# EAGLE design New_Multirotor_GPS (EAGLE 6.3)
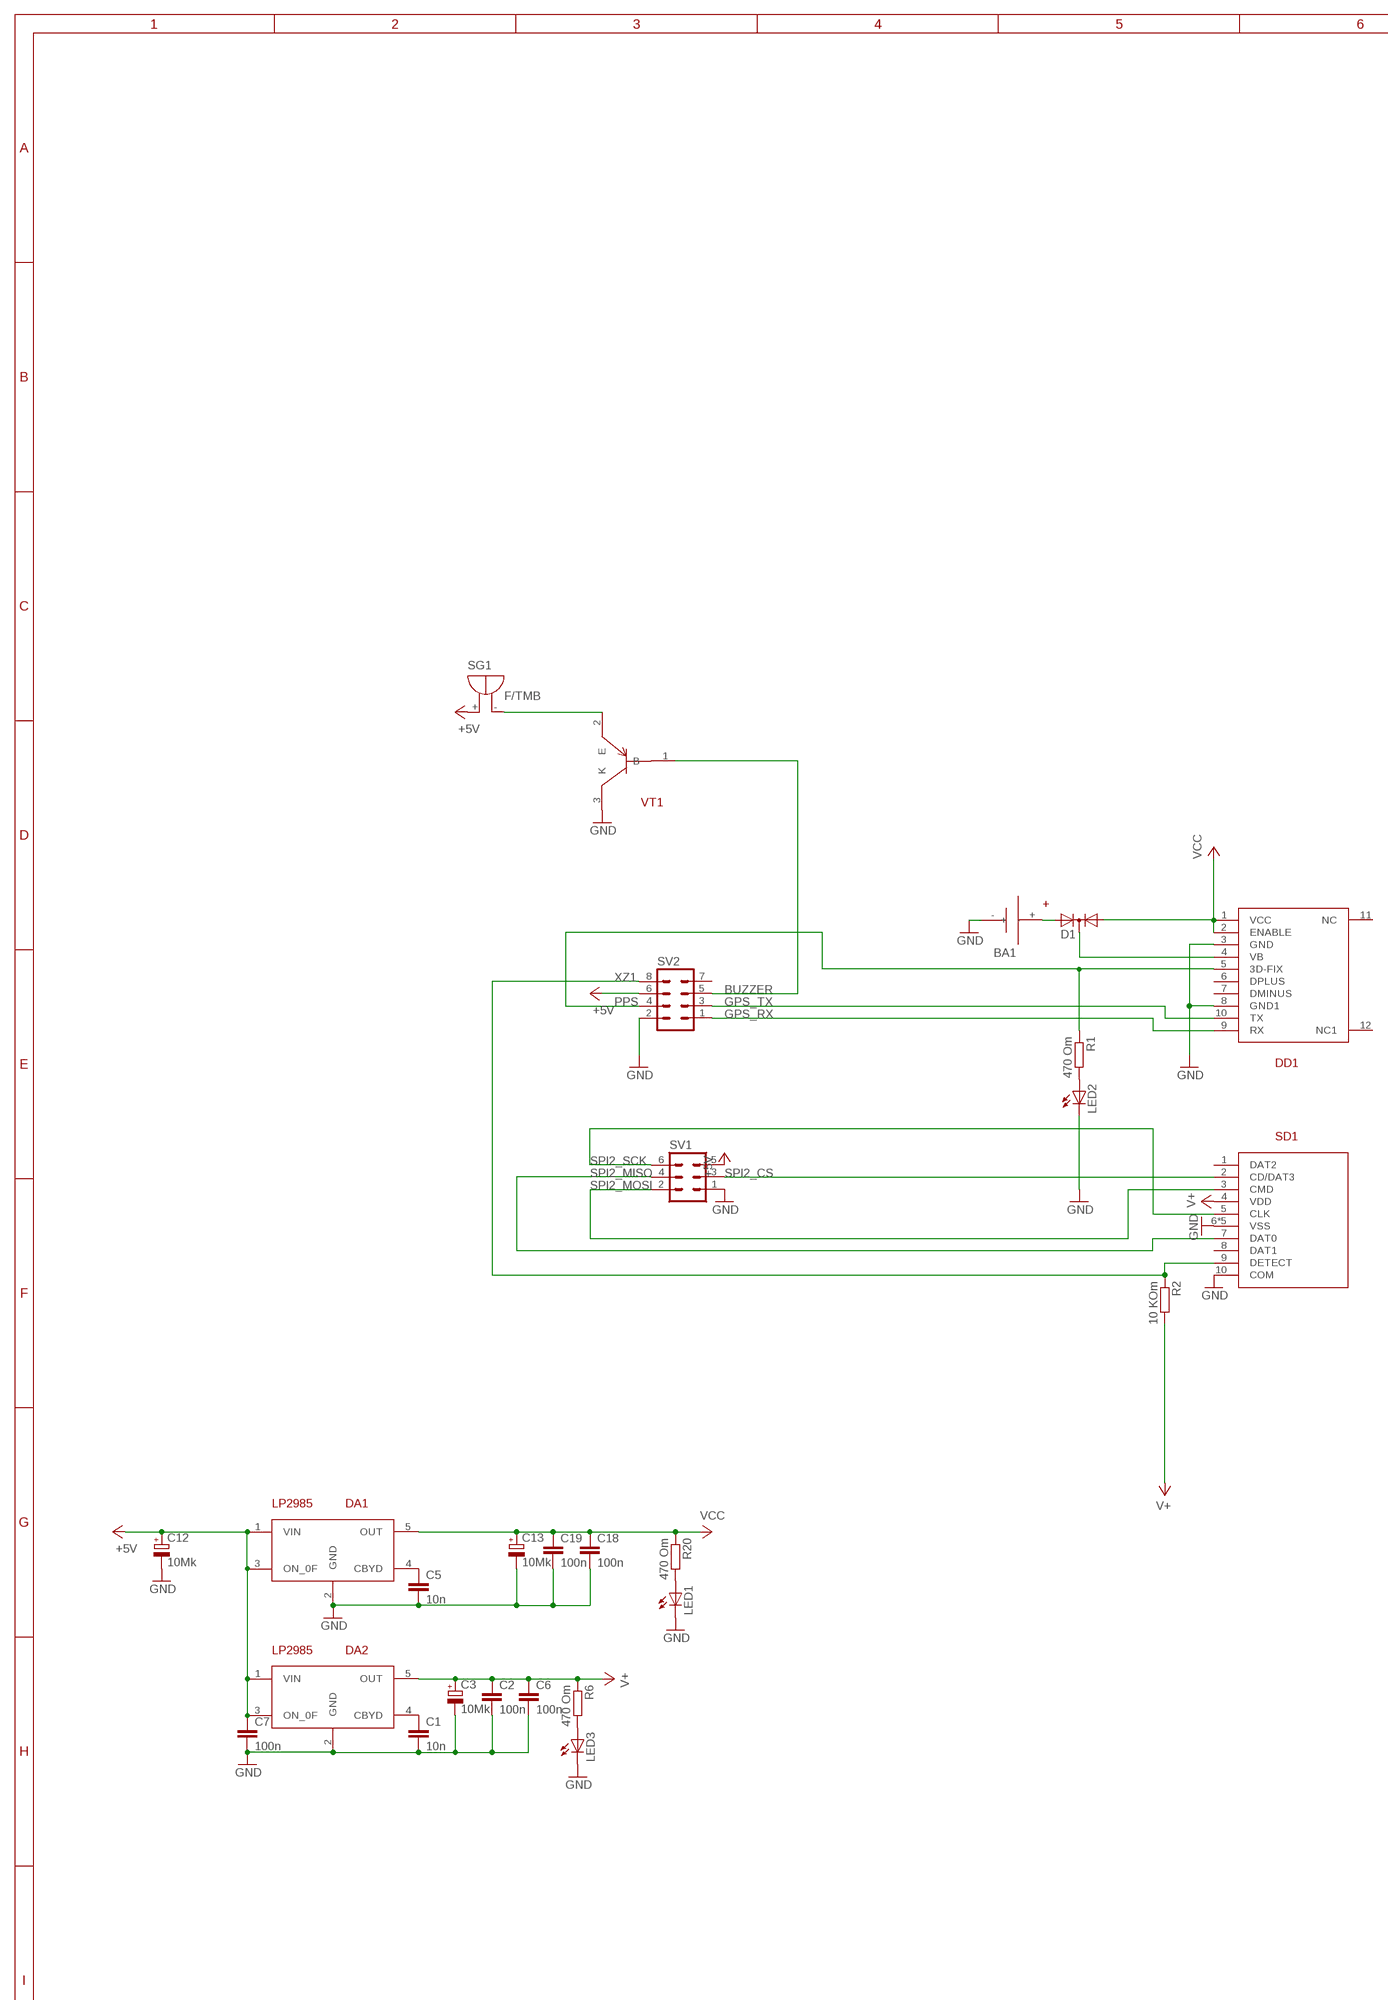
[diagram p0: schematic, sheet 1, part 1 of 2]
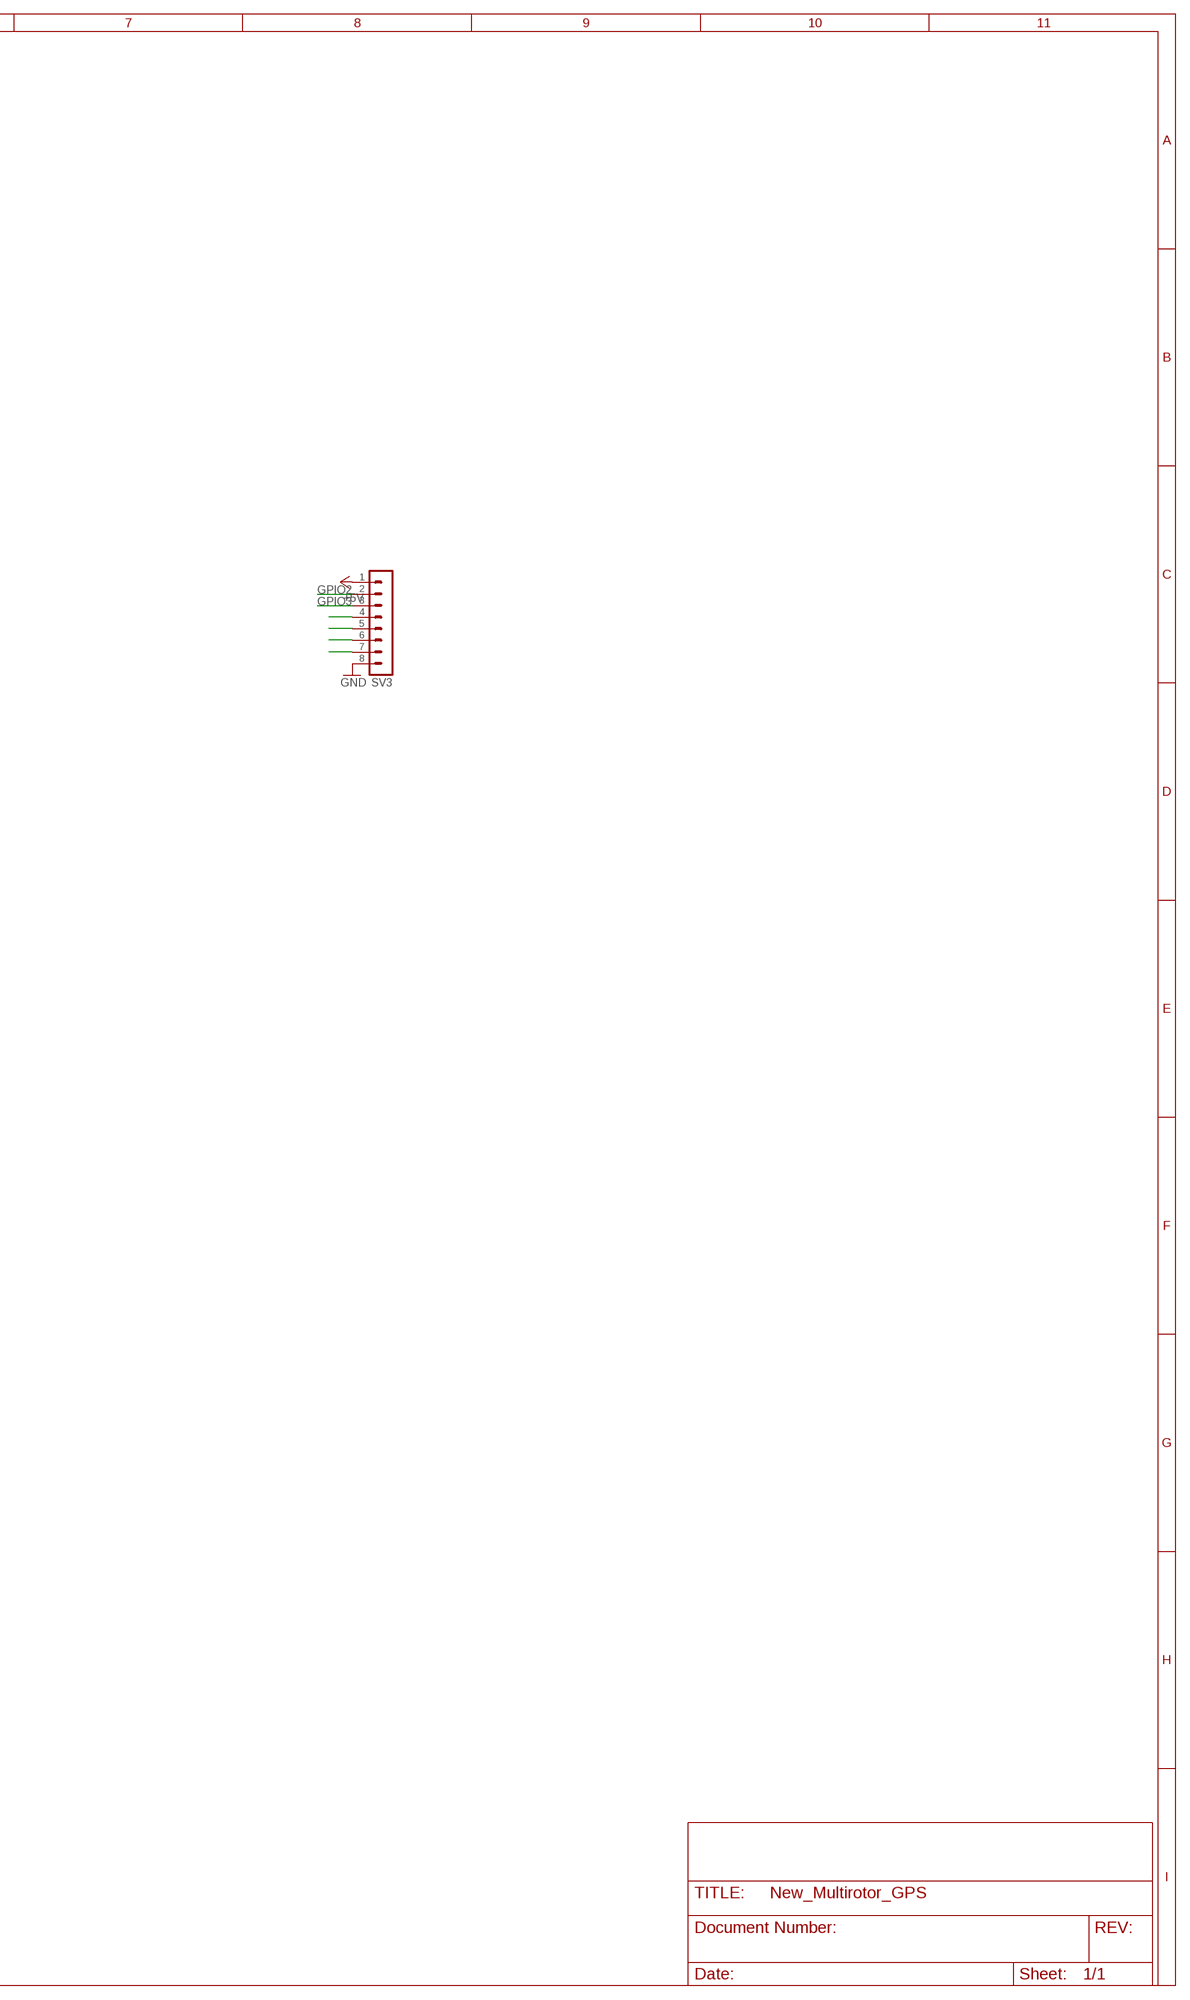
[diagram p1: schematic, sheet 1, part 2 of 2]

## Parts
BA1  BAT  [BAT]
C1  10n  C-EUC0603K  [C0603K]
C2  100n  C-EUC0603K  [C0603K]
C3  10Mk  CPOL-EUA/3216-18W  [A/3216-18W]
C5  10n  C-EUC0603K  [C0603K]
C6  100n  C-EUC0603K  [C0603K]
C7  100n  C-EUC0603K  [C0603K]
C12  10Mk  CPOL-EUA/3216-18W  [A/3216-18W]
C13  10Mk  CPOL-EUA/3216-18W  [A/3216-18W]
C18  100n  C-EUC0603K  [C0603K]
C19  100n  C-EUC0603K  [C0603K]
D1  DIODE-2AC|CASOT23  [SOT23]
DA1  LP2985  3.3  [SOT23-5L]
DA2  LP2985  3.3  [SOT23-5L]
DD1  FGPMMOPA6B  [FGPMMOPA6B]
LED1  LEDCHIPLED_0603  [CHIPLED_0603]
LED2  LEDCHIPLED_0603  [CHIPLED_0603]
LED3  LEDCHIPLED_0603  [CHIPLED_0603]
R1  470 Om  R-EU_R0603  [R0603]
R2  10 KOm  R-EU_R0603  [R0603]
R6  470 Om  R-EU_R0603  [R0603]
R20  470 Om  R-EU_R0603  [R0603]
SD1  MICROCD_MAIN  [MICROSD_MAIN]
SG1  F/TMB  [F/TMB]
SV1  MA03-2  [MA03-2]
SV2  MA04-2  [MA04-2]
SV3  MA08-1  [MA08-1]
VT1  MMBT3906  [SOT23B-3]

## Nets
+5V: C7.1 C12.+ DA1.1(VIN) DA1.3(ON_0F) DA2.1(VIN) DA2.3(ON_0F) SG1.+ SV1.5 SV2.6 SV3.1
ADC1: SV3.4
ADC2: SV3.5
ADC3: SV3.6
ADC4: SV3.7
BUZZER: SV2.5 VT1.1(B)
GND: BA1.- C1.2 C2.2 C3.- C5.2 C6.2 C7.2 C12.- C13.- C18.2 C19.2 DA1.2(GND) DA2.2(GND) DD1.3(GND) DD1.8(GND1) LED1.C LED2.C LED3.C SD1.6(VSS) SD1.10(COM) SD1.11(VSS) SD1.12(VSS) SD1.13(VSS) SD1.14(VSS) SV1.1 SV2.2 SV3.8 VT1.3(K)
GPIO2: SV3.2
GPIO3: SV3.3
GPS_RX: DD1.9(RX) SV2.1
GPS_TX: DD1.10(TX) SV2.3
N$1: LED2.A R1.2
N$2: SG1.- VT1.2(E)
N$3: D1.3(C) DD1.4(VB)
N$4: C1.1 DA2.4(CBYD)
N$5: BA1.+ D1.2(A2)
N$6: LED3.A R6.2
N$13: LED1.A R20.2
N$52: C5.1 DA1.4(CBYD)
PPS: DD1.5(3D-FIX) R1.1 SV2.4
SPI2_CS: SD1.2(CD/DAT3) SV1.3
SPI2_MISO: SD1.7(DAT0) SV1.4
SPI2_MOSI: SD1.3(CMD) SV1.2
SPI2_SCK: SD1.5(CLK) SV1.6
V+: C2.1 C3.+ C6.1 DA2.5(OUT) R2.2 R6.1 SD1.4(VDD)
VCC: C13.+ C18.1 C19.1 D1.1(A1) DA1.5(OUT) DD1.1(VCC) DD1.2(ENABLE) R20.1
XZ1: R2.1 SD1.9(DETECT) SV2.8
Unconnected: DD1.6(DPLUS) DD1.7(DMINUS) DD1.11(NC) DD1.12(NC1) SD1.1(DAT2) SD1.8(DAT1) SV2.7

## Library data of the parts
BA1 = pepelac:BAT
C1 C2 C5-C7 C18 C19 = resistor:C-EU: CAPACITOR, European symbol
C3 C12 C13 = resistor:CPOL-EU: POLARIZED CAPACITOR, European symbol
D1 = diode:DIODE-2AC|CA: Dual DIODE Anode-Cathode|Cathode-Anode
DA1 DA2 = pepelac:3.3
DD1 = pepelac:FGPMMOPA6B
LED1-LED3 = led:LED: LED OSRAM: - CHIPLED LG R971, LG N971, LY N971, LG Q971, LY Q971, LO R971, LY R971 LH N974, LH R974 LS Q976, LO Q976, LY Q976 LO Q996 - Hyper CHIPLED LW Q18S LB Q993, LB Q99A, LB R99A - SideLED LS A670, LO A670, LY A670, LG A670, LP A670 LB A673, LV A673, LT A673, LW A673 LH A674 LY A675 LS A676, LA A676, LO A676, LY A676, LW A676 LS A679, LY A679, LG A679 - Hyper Micro SIDELED® LS Y876, LA Y876, LO Y876, LY Y876 LT Y87S - SmartLED LW L88C, LW L88S LB L89C, LB L89S, LG L890 LS L89K, LO L89K, LY L89K LS L896, LA L896, LO L896, LY L896 - TOPLED LS T670, LO T670, LY T670, LG T670, LP T670 LSG T670, LSP T670, LSY T670, LOP T670, LYG T670 LG T671, LOG T671, LSG T671 LB T673, LV T673, LT T673, LW T673 LH T674 LS T676, LA T676, LO T676, LY T676, LB T676, LH T676, LSB T676, LW T676 LB T67C, LV T67C, LT T67C, LS T67K, LO T67K, LY T67K, LW E67C LS E67B, LA E67B, LO E67B, LY E67B, LB E67C, LV E67C, LT E67C LW T67C LS T679, LY T679, LG T679 LS T770, LO T770, LY T770, LG T770, LP T770 LB T773, LV T773, LT T773, LW T773 LH T774 LS E675, LA E675, LY E675, LS T675 LS T776, LA T776, LO T776, LY T776, LB T776 LHGB T686 LT T68C, LB T68C - Hyper Mini TOPLED® LB M676 - Mini TOPLED Santana® LG M470 LS M47K, LO M47K, LY M47K Source: http://www.osram.convergy.de LUXEON: - LUMILED® LXK2-PW12-R00, LXK2-PW12-S00, LXK2-PW14-U00, LXK2-PW14-V00 LXK2-PM12-R00, LXK2-PM12-S00, LXK2-PM14-U00 LXK2-PE12-Q00, LXK2-PE12-R00, LXK2-PE12-S00, LXK2-PE14-T00, LXK2-PE14-U00 LXK2-PB12-K00, LXK2-PB12-L00, LXK2-PB12-M00, LXK2-PB14-N00, LXK2-PB14-P00, LXK2-PB14-Q00 LXK2-PR12-L00, LXK2-PR12-M00, LXK2-PR14-Q00, LXK2-PR14-R00 LXK2-PD12-Q00, LXK2-PD12-R00, LXK2-PD12-S00 LXK2-PH12-R00, LXK2-PH12-S00 LXK2-PL12-P00, LXK2-PL12-Q00, LXK2-PL12-R00 Source: www.luxeon.com KINGBRIGHT: KA-3528ASYC Source: www.kingbright.com
R1 R2 R6 R20 = resistor:R-EU_: RESISTOR, European symbol
SD1 = pepelac:MICROCD_MAIN
SG1 = buzzer:F/TMB: BUZZER Source: Buerklin; OC_FARNELL: unknown; OC_NEWARK: unknown
SV1 = con-lstb:MA03-2: PIN HEADER; OC_FARNELL: unknown; OC_NEWARK: unknown
SV2 = con-lstb:MA04-2: PIN HEADER; OC_FARNELL: unknown; OC_NEWARK: unknown
SV3 = con-lstb:MA08-1: PIN HEADER; OC_FARNELL: unknown; OC_NEWARK: unknown
VT1 = pepelac:MMBT3906

## Net classes
0 Def: width 0.406 mm, clearance 0.152 mm

## Board
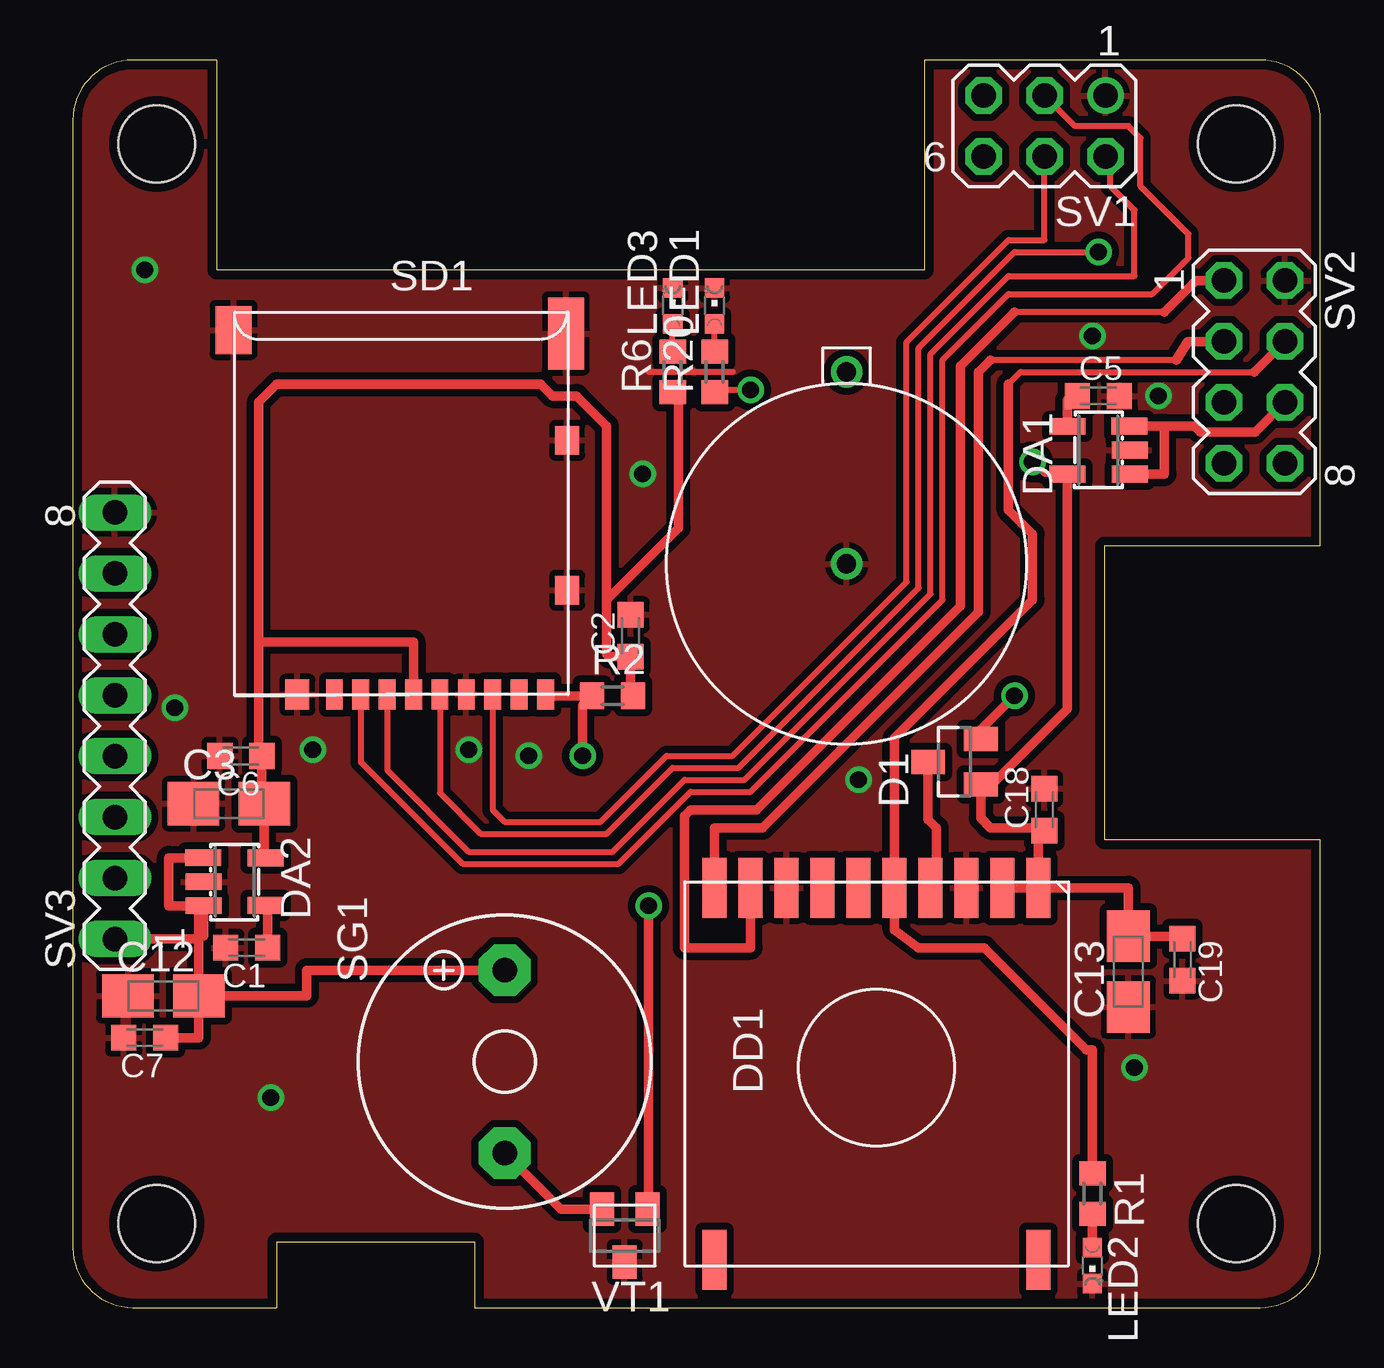
[diagram p2: board, top side]
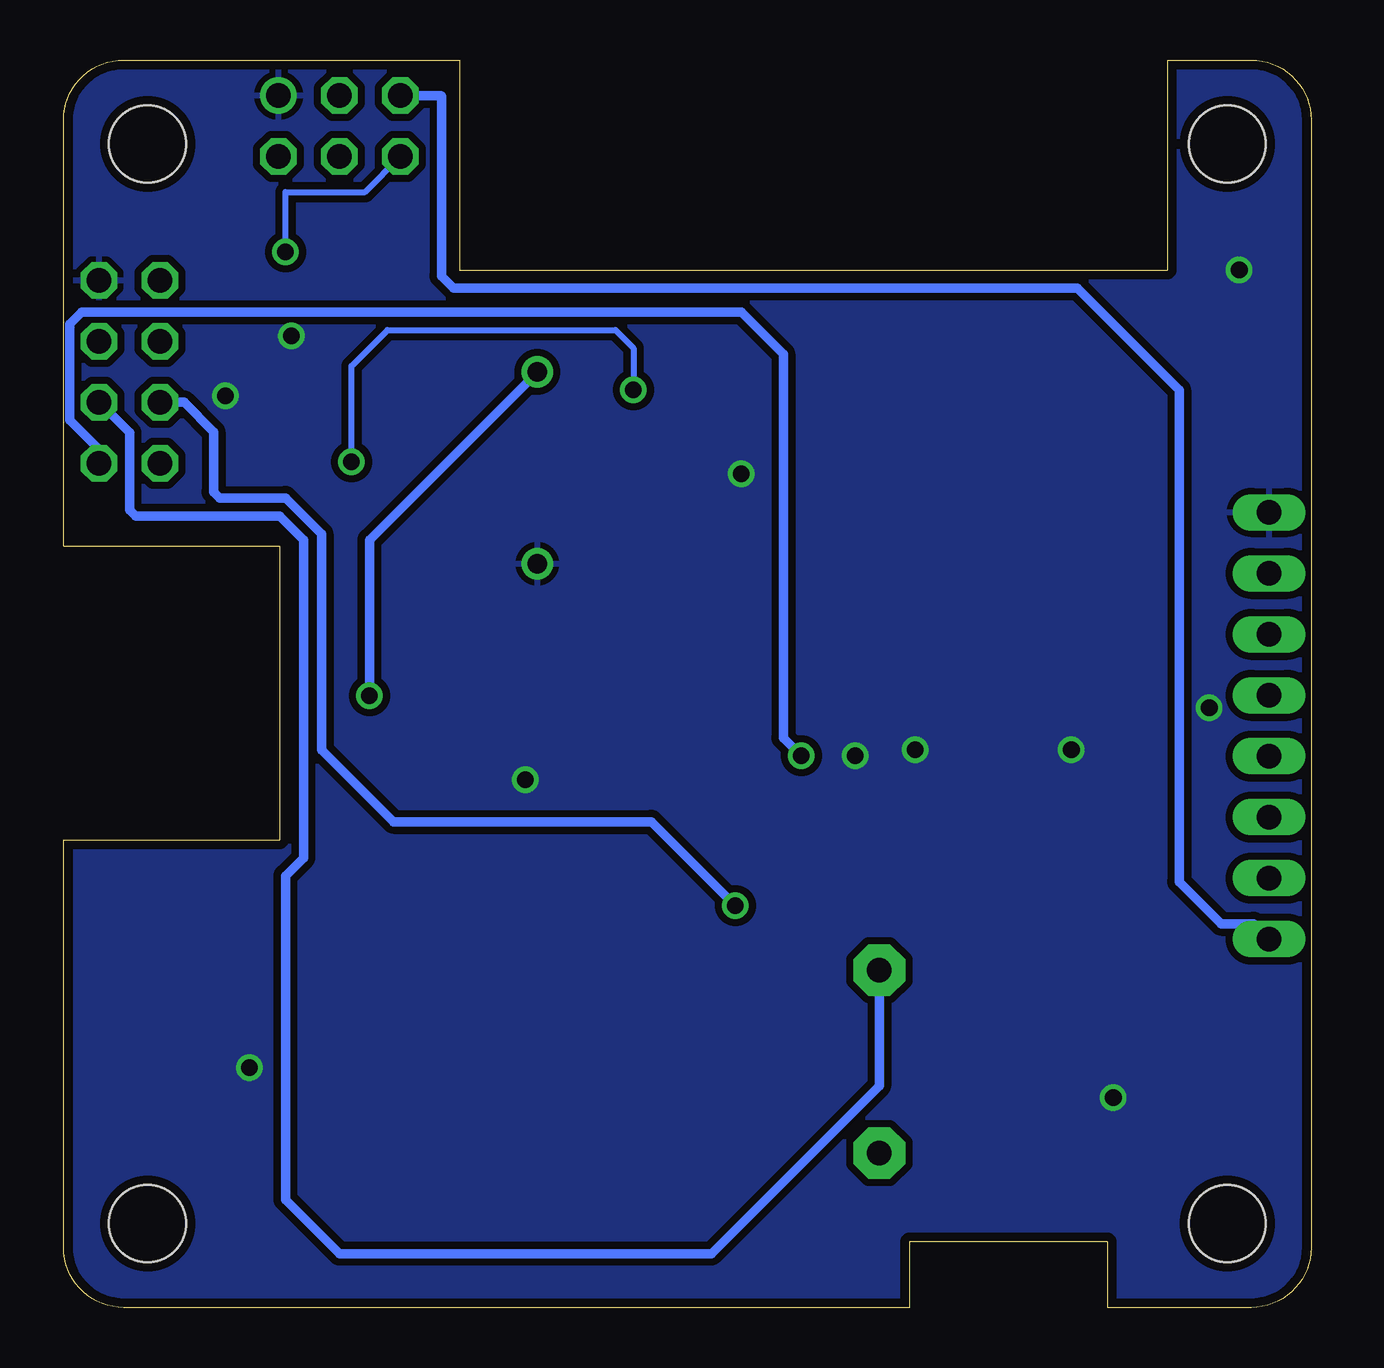
[diagram p3: board, bottom side, seen from below]

Size 52 x 52 mm. Coordinates in mm from the lower left corner, seen from the top.
Outline: 0,49.5 0,2.5 arc90 2.5,0 8.5,0 8.5,2.75 16.75,2.75 16.75,0 49.5,0 arc90 52,2.5 52,19.5 43,19.5 43,31.75 52,31.75 52,49.5 arc90 49.5,52 35.5,52 35.5,43.25 6,43.25 6,52 2.5,52 arc90 0,49.5
Copper layers (1*16): Top 0.035mm / dielectric 1.5mm / Bottom 0.035mm
Design rules "default *": minimum track width 10mil, minimum drill 24mil, track to track 8mil, track to pad 8mil, pad to pad 8mil, via to via 8mil, smd to smd 8mil, copper to edge 15mil, drill to drill 8mil, minimum pad ring 10mil, minimum via ring 8mil, stop-mask expansion 4mil, vias tented up to drill 0mil, thermal gap 10mil
Holes 3.2 mm at 3.5,3.5 48.5,3.5 48.5,48.5 3.5,48.5

### Footprints (pad centres in the part's own frame; a part is rotated, then mirrored left to right if it is on the bottom)
BAT = drill 0.8: + -8,0; - 0,0
C0603K = smd 1.05 x 1.08: 1 -0.875,0; 2 0.875,0
A/3216-18W = smd 2.15 x 1.8: + 1.475,0; - -1.475,0
SOT23 = smd 1 x 1.4: 1 -0.95,-1.1; 2 0.95,-1.1; 3 0,1.1
SOT23-5L = smd 0.7 x 1.5: 1 -1.002,-1.305; 2 0,-1.3; 3 0.997,-1.294; 4 0.991,1.3; 5 -0.998,1.293
FGPMMOPA6B = smd 2.5 x 1: 1 -7.5,6.75; 2 -7.5,5.25; 3 -7.5,3.75; 4 -7.5,2.25; 5 -7.5,0.75; 6 -7.5,-0.75; 7 -7.5,-2.25; 8 -7.5,-3.75; 9 -7.5,-5.25; 10 -7.5,-6.75; 11 8,6.75; 12 8,-6.75
CHIPLED_0603 = smd 0.8 x 0.8: A 0,-0.75; C 0,0.75
R0603 = smd 1 x 1.1: 1 -0.85,0; 2 0.85,0
MICROSD_MAIN = smd 0.7 x 1.25: 1 -2.15,5.95; 2 -3.25,5.95; 3 -4.35,5.95; 4 -5.45,5.95; 5 -6.55,5.95; 6 -7.65,5.95; 7 -8.75,5.95; 8 -9.85,5.95; 9 -10.95,5.95 | smd 1 x 1.2: 10 -11.85,1.6; 11 -11.85,-4.65 | smd 1.5 x 3: 12 -11.8,-9.1 | smd 1.5 x 2: 13 2.05,-9.25 | smd 1 x 1.25: 14 -0.6,5.95
F/TMB = drill 1.016 pad 2.159 octagon: + 3.81,0; - -3.81,0
MA03-2 = drill 1.016: 1 -2.54,-1.27 | drill 1.016 octagon: 2 -2.54,1.27; 3 0,-1.27; 4 0,1.27; 5 2.54,-1.27; 6 2.54,1.27
MA04-2 = drill 1.016 octagon: 1 -3.81,-1.27; 2 -3.81,1.27; 3 -1.27,-1.27; 4 -1.27,1.27; 5 1.27,-1.27; 6 1.27,1.27; 7 3.81,-1.27; 8 3.81,1.27
MA08-1 = drill 1.016 long: 1 -8.89,0; 2 -6.35,0; 3 -3.81,0; 4 -1.27,0; 5 1.27,0; 6 3.81,0; 7 6.35,0; 8 8.89,0
SOT23B-3 = smd 1 x 1.4: 1 -0.95,-1.1; 2 0.95,-1.1; 3 0,1.1

### Placement (x,y rotation side)
BA1  32.25,31 270 top
C1  7.25,15 180 top
C2  23.25,28 90 top
C3  6.51,21 0 top
C5  42.75,38 0 top
C6  7,23 180 top
C7  3,11.25 180 top
C12  3.77,12.99 0 top
C13  44,14 90 top
C18  40.5,20.75 90 top
C19  46.25,14.5 270 top
D1  36.75,22.75 90 top
DA1  42.75,35.74 90 top
DA2  6.75,17.75 270 top
DD1  33.5,10 270 top
LED1  26.75,41.75 0 top
LED2  42.5,1.75 180 top
LED3  25,41.75 0 top
R1  42.5,4.75 270 top
R2  22.5,25.5 0 top
R6  25,39 90 top
R20  26.75,39 90 top
SD1  8.75,31.5 180 top
SG1  18,10.25 90 top
SV1  40.5,49.25 180 top
SV2  49.25,39 270 top
SV3  1.75,24.25 90 top
VT1  23,3 180 top

### Tracks (layer width: path | path; a pad name or v marks a point on that pad's centre or on a via)
+5V
  Top 0.4: SV3.1 5.25,15.36 5.25,15.5 5.45,15.5 DA2.3 | DA2.3 4,16.75 4,18.75 DA2.1 | DA2.3 5.25,16.75 C12.+ | C12.+ 5.25,11.25 C7.1 | SG1.+ 9.75,14.06 9.75,13 C12.+ | DA1.1 45.49,34.74 45.5,34.75 45.5,36.75 | 45.5,36.75 44.06,36.75 DA1.3 45.49,36.74 45.5,36.75 | 45.5,36.75 46.75,36.75 47,36.5 49.29,36.5 SV2.6
  Bottom 0.4: SG1.+ 18,9.25 25,2.25 40.5,2.25 42.75,4.5 42.75,18 42,18.75 42,32 43,33 49,33 49.25,33.25 49.25,36.46 SV2.6 | SV1.5 36.27,50.52 36.25,50.5 36.25,43 35.75,42.5 9.75,42.5 5.5,38.25 5.5,17.75 3.75,16 2.39,16 SV3.1
BUZZER  (via drill 0.7)
  Top 0.4: v24,16.75 24,4.15 VT1.1
  Bottom 0.4: SV2.5 46.98,37.73 45.75,36.5 45.75,34 45.5,33.75 42.75,33.75 41.25,32.25 41.25,23.25 38.25,20.25 27.5,20.25 v24,16.75
GND  (via drill 0.7)
  Top 0.25: 27.5,39 24,39
  other vias: 16.5,23.25 45.25,38 42.5,40.5 44.25,10 32.75,22 4.25,25 10,23.25 8.25,8.75 3,43.25 23.75,34.75 19,23
  pour Top (isolate 0.3): 0,49.5 0,2.5 arc90 2.5,0 49.5,0 49.75,0 arc90 52,2.25 52,49.5 arc90 49.5,52 2.5,52 arc90
  pour Bottom (isolate 0.3): 0,49.5 0,2.5 arc90 2.5,0 49.5,0 49.75,0 arc90 52,2.25 52,49.5 arc90 49.5,52 2.5,52 arc90
GPS_RX
  Top 0.25: 45.5,41.5 39.25,41.5
  Top 0.4: SV2.1 46.81,42.81 45.5,41.5 | 39.25,41.5 37,39.25 37,29.25 28.5,20.75 25.75,20.75 25.5,20.5 25.5,15 28.25,15 DD1.9
GPS_TX
  Top 0.25: 46,39.5 38.25,39.5
  Top 0.4: SV2.3 46.48,40.27 46,39.5 | 38.25,39.5 37.75,39 37.75,29 28.75,20 26.75,20 DD1.10
N$1
  Top 0.4: R1.2 LED2.A
N$2
  Top 0.4: VT1.2 20.34,4.1 SG1.-
N$3
  Top 0.4: D1.3 35.65,20.35 36,20 36,17.75 DD1.4
N$4
  Top 0.4: DA2.4 8.12,16.75 C1.1
N$5  (via drill 0.7)
  Top 0.4: D1.2 37.85,24.1 v39.25,25.5
  Bottom 0.4: v39.25,25.5 39.25,32 BA1.+
N$6
  Top 0.25: R6.2 LED3.A
N$13
  Top 0.25: R20.2 LED1.A | LED1.A
N$52
  Top 0.4: DA1.4 41.45,37.82 C5.1
PPS
  Top 0.25: 39,38.5 39.5,39 49.25,39
  Top 0.4: R1.1 42.5,10.75 42.25,10.75 38,15 35.25,15 34.25,15.75 DD1.5 34.25,23.75 40,29.5 40,32.25 39,33.25 39,38.5 | 49.25,39 SV2.4
SPI2_CS
  Top 0.25: SD1.2 12,22.75 16.25,18.5 22.75,18.5 25.75,21.5 28.25,21.5 36.25,29.5 36.25,39.5 39,42.25 45,42.25 46.5,43.75 46.5,44.75 44.5,46.75 44.5,48.75 44,49.25 41.77,49.25 SV1.3
SPI2_MISO
  Top 0.25: SD1.7 17.5,20.75 18,20.25 22,20.25 24.75,23 27.5,23 34.75,30.25 34.75,40.25 39,44.5 40.5,44.5 SV1.4
SPI2_MOSI
  Top 0.25: SD1.3 13.1,22.4 16.5,19 22.5,19 25.5,22 28,22 35.75,29.75 35.75,39.75 39,43 44.25,43 44.25,45.75 43.25,46.75 43.25,47.77 SV1.2
SPI2_SCK  (via drill 0.7)
  Top 0.25: SD1.5 15.3,21.45 17,19.75 22.25,19.75 25,22.5 27.75,22.5 35.25,30 35.25,40 39.25,44 v42.75,44
  Bottom 0.25: v42.75,44 42.75,46.5 39.44,46.5 SV1.6
V+
  Top 0.4: DA2.5 7.98,18.74 C3.+ 7.88,21 C6.1 7.75,23 7.75,27.75 | SD1.4 14.2,27.75 7.75,27.75 | R2.2 23.25,25.5 C2.1 22.38,27.12 22.25,27.25 22.25,29.5 | 22.25,29.5 25.25,32.5 25.25,37.9 R6.1 | 7.75,27.75 7.75,37.75 8.5,38.5 19.5,38.5 20,38 21,38 22.25,36.75 22.25,29.5
VCC  (via drill 0.7)
  Top 0.25: DA1.5 40.51,34.74 v40,35.25 | v28.25,38.25 26.85,38.25 R20.1
  Top 0.4: DD1.2 DD1.1 | DD1.1 44,17.5 C13.+ 46.15,15.48 C19.1 | DD1.1 40.25,19.63 C18.1 40.37,20 38.25,20 37.85,20.4 D1.1 38.05,22 38.5,22 41.45,24.95 DA1.5
  Bottom 0.25: v40,35.25 40,39.25 38.5,40.75 29,40.75 28.25,40 v28.25,38.25
XZ1  (via drill 0.7)
  Top 0.4: SD1.9 19.7,25.5 R2.1 21.25,25.1 v21.25,23
  Bottom 0.4: SV2.8 50.52,35.77 51.75,37 51.75,41 51.25,41.5 23.75,41.5 22,39.75 22,23.75 v21.25,23